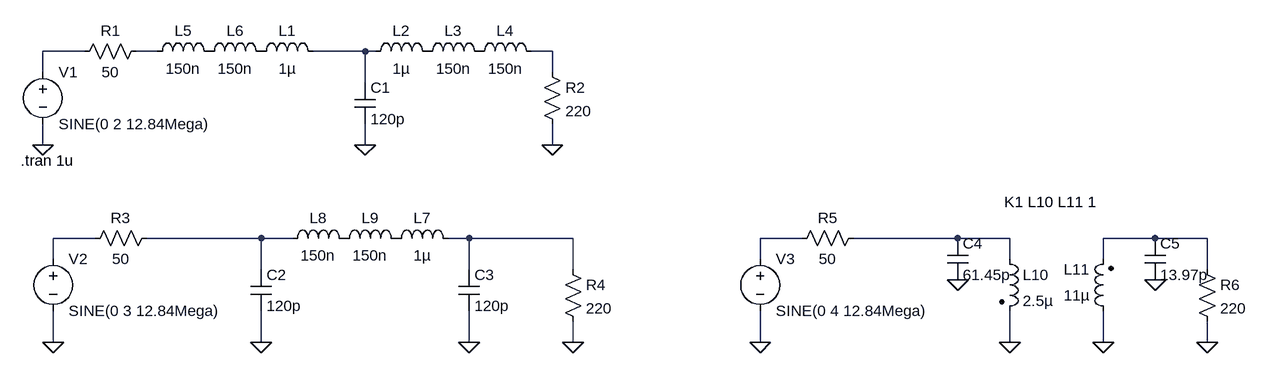
[diagram p0: schematic Draft1.asc]
Draft1.asc, the LTspice schematic file:
Version 4
SHEET 1 1540 680
WIRE -256 48 -320 48
WIRE -144 48 -176 48
WIRE 176 48 96 48
WIRE 192 48 176 48
WIRE 464 48 432 48
WIRE -320 80 -320 48
WIRE 464 80 464 48
WIRE 176 96 176 48
WIRE -320 192 -320 160
WIRE 176 192 176 160
WIRE 464 192 464 160
WIRE -240 336 -304 336
WIRE 16 336 -160 336
WIRE 64 336 16 336
WIRE 336 336 304 336
WIRE 496 336 336 336
WIRE 848 336 784 336
WIRE 1088 336 928 336
WIRE 1168 336 1088 336
WIRE 1392 336 1312 336
WIRE 1472 336 1392 336
WIRE -304 368 -304 336
WIRE 784 368 784 336
WIRE 1168 368 1168 336
WIRE 1312 368 1312 336
WIRE 16 384 16 336
WIRE 336 384 336 336
WIRE 496 384 496 336
WIRE 1472 384 1472 336
WIRE -304 496 -304 448
WIRE 16 496 16 448
WIRE 336 496 336 448
WIRE 496 496 496 464
WIRE 784 496 784 448
WIRE 1168 496 1168 448
WIRE 1312 496 1312 448
WIRE 1472 496 1472 464
FLAG -320 192 0
FLAG 176 192 0
FLAG 464 192 0
FLAG 496 496 0
FLAG 16 496 0
FLAG 336 496 0
FLAG -304 496 0
FLAG 784 496 0
FLAG 1472 496 0
FLAG 1168 496 0
FLAG 1312 496 0
FLAG 1088 400 0
FLAG 1392 400 0
SYMBOL voltage -320 64 R0
WINDOW 123 0 0 Left 0
WINDOW 39 0 0 Left 0
SYMATTR InstName V1
SYMATTR Value SINE(0 2 12.84Mega)
SYMBOL ind 0 64 R270
WINDOW 0 32 56 VTop 2
WINDOW 3 5 56 VBottom 2
SYMATTR InstName L1
SYMATTR Value 1µ
SYMBOL ind 176 64 R270
WINDOW 0 32 56 VTop 2
WINDOW 3 5 56 VBottom 2
SYMATTR InstName L2
SYMATTR Value 1µ
SYMBOL cap 160 96 R0
SYMATTR InstName C1
SYMATTR Value 120p
SYMBOL res -160 32 R90
WINDOW 0 0 56 VBottom 2
WINDOW 3 32 56 VTop 2
SYMATTR InstName R1
SYMATTR Value 50
SYMBOL res 448 64 R0
SYMATTR InstName R2
SYMATTR Value 220
SYMBOL ind 256 64 R270
WINDOW 0 32 56 VTop 2
WINDOW 3 5 56 VBottom 2
SYMATTR InstName L3
SYMATTR Value 150n
SYMBOL ind 336 64 R270
WINDOW 0 32 56 VTop 2
WINDOW 3 5 56 VBottom 2
SYMATTR InstName L4
SYMATTR Value 150n
SYMBOL ind -160 64 R270
WINDOW 0 32 56 VTop 2
WINDOW 3 5 56 VBottom 2
SYMATTR InstName L5
SYMATTR Value 150n
SYMBOL ind -80 64 R270
WINDOW 0 32 56 VTop 2
WINDOW 3 5 56 VBottom 2
SYMATTR InstName L6
SYMATTR Value 150n
SYMBOL res -144 320 R90
WINDOW 0 0 56 VBottom 2
WINDOW 3 32 56 VTop 2
SYMATTR InstName R3
SYMATTR Value 50
SYMBOL voltage -304 352 R0
WINDOW 123 0 0 Left 0
WINDOW 39 0 0 Left 0
SYMATTR InstName V2
SYMATTR Value SINE(0 3 12.84Mega)
SYMBOL ind 208 352 R270
WINDOW 0 32 56 VTop 2
WINDOW 3 5 56 VBottom 2
SYMATTR InstName L7
SYMATTR Value 1µ
SYMBOL ind 48 352 R270
WINDOW 0 32 56 VTop 2
WINDOW 3 5 56 VBottom 2
SYMATTR InstName L8
SYMATTR Value 150n
SYMBOL ind 128 352 R270
WINDOW 0 32 56 VTop 2
WINDOW 3 5 56 VBottom 2
SYMATTR InstName L9
SYMATTR Value 150n
SYMBOL cap 0 384 R0
SYMATTR InstName C2
SYMATTR Value 120p
SYMBOL cap 320 384 R0
SYMATTR InstName C3
SYMATTR Value 120p
SYMBOL res 480 368 R0
SYMATTR InstName R4
SYMATTR Value 220
SYMBOL res 944 320 R90
WINDOW 0 0 56 VBottom 2
WINDOW 3 32 56 VTop 2
SYMATTR InstName R5
SYMATTR Value 50
SYMBOL voltage 784 352 R0
WINDOW 123 0 0 Left 0
WINDOW 39 0 0 Left 0
SYMATTR InstName V3
SYMATTR Value SINE(0 4 12.84Mega)
SYMBOL res 1456 368 R0
SYMATTR InstName R6
SYMATTR Value 220
SYMBOL ind2 1152 352 R0
SYMATTR InstName L10
SYMATTR Value 2.5µ
SYMATTR Type ind
SYMBOL ind2 1328 464 R180
WINDOW 0 36 80 Left 2
WINDOW 3 36 40 Left 2
SYMATTR InstName L11
SYMATTR Value 11µ
SYMATTR Type ind
SYMBOL cap 1072 336 R0
SYMATTR InstName C4
SYMATTR Value 61.45p
SYMBOL cap 1376 336 R0
SYMATTR InstName C5
SYMATTR Value 13.97p
TEXT -354 216 Left 2 !.tran 1u
TEXT 1160 280 Left 2 !K1 L10 L11 1

The netlist it stands for:
* Draft1.asc
V1 N001 0 SINE(0 2 12.84Mega)
L1 P001 N003 1µ
L2 N003 P002 1µ
C1 N003 0 120p
R1 N002 N001 50
R2 N004 0 220
L3 P002 P003 150n
L4 P003 N004 150n
L5 N002 P004 150n
L6 P004 P001 150n
R3 N006 N005 50
V2 N005 0 SINE(0 3 12.84Mega)
L7 P005 N007 1µ
L8 N006 P006 150n
L9 P006 P005 150n
C2 N006 0 120p
C3 N007 0 120p
R4 N007 0 220
R5 N009 N008 50
V3 N008 0 SINE(0 4 12.84Mega)
R6 N010 0 220
L10 N009 0 2.5µ
L11 0 N010 11µ
C4 N009 0 61.45p
C5 N010 0 13.97p
.tran 1u
K1 L10 L11 1
.backanno
.end